# EasyEDA Pro project 嘉立创第九届立创电子设计温湿度检测装置.epro

# Schematic Schematic1
Create Date: 2024-07-06; Page Name: P1; Project Name: 嘉立创第九届立创电子设计温湿度检测装置; Schematic Name: Schematic1; Update Date: 2024-07-06; Company: 嘉立创EDA; Page Size: A4; Version: V1.0
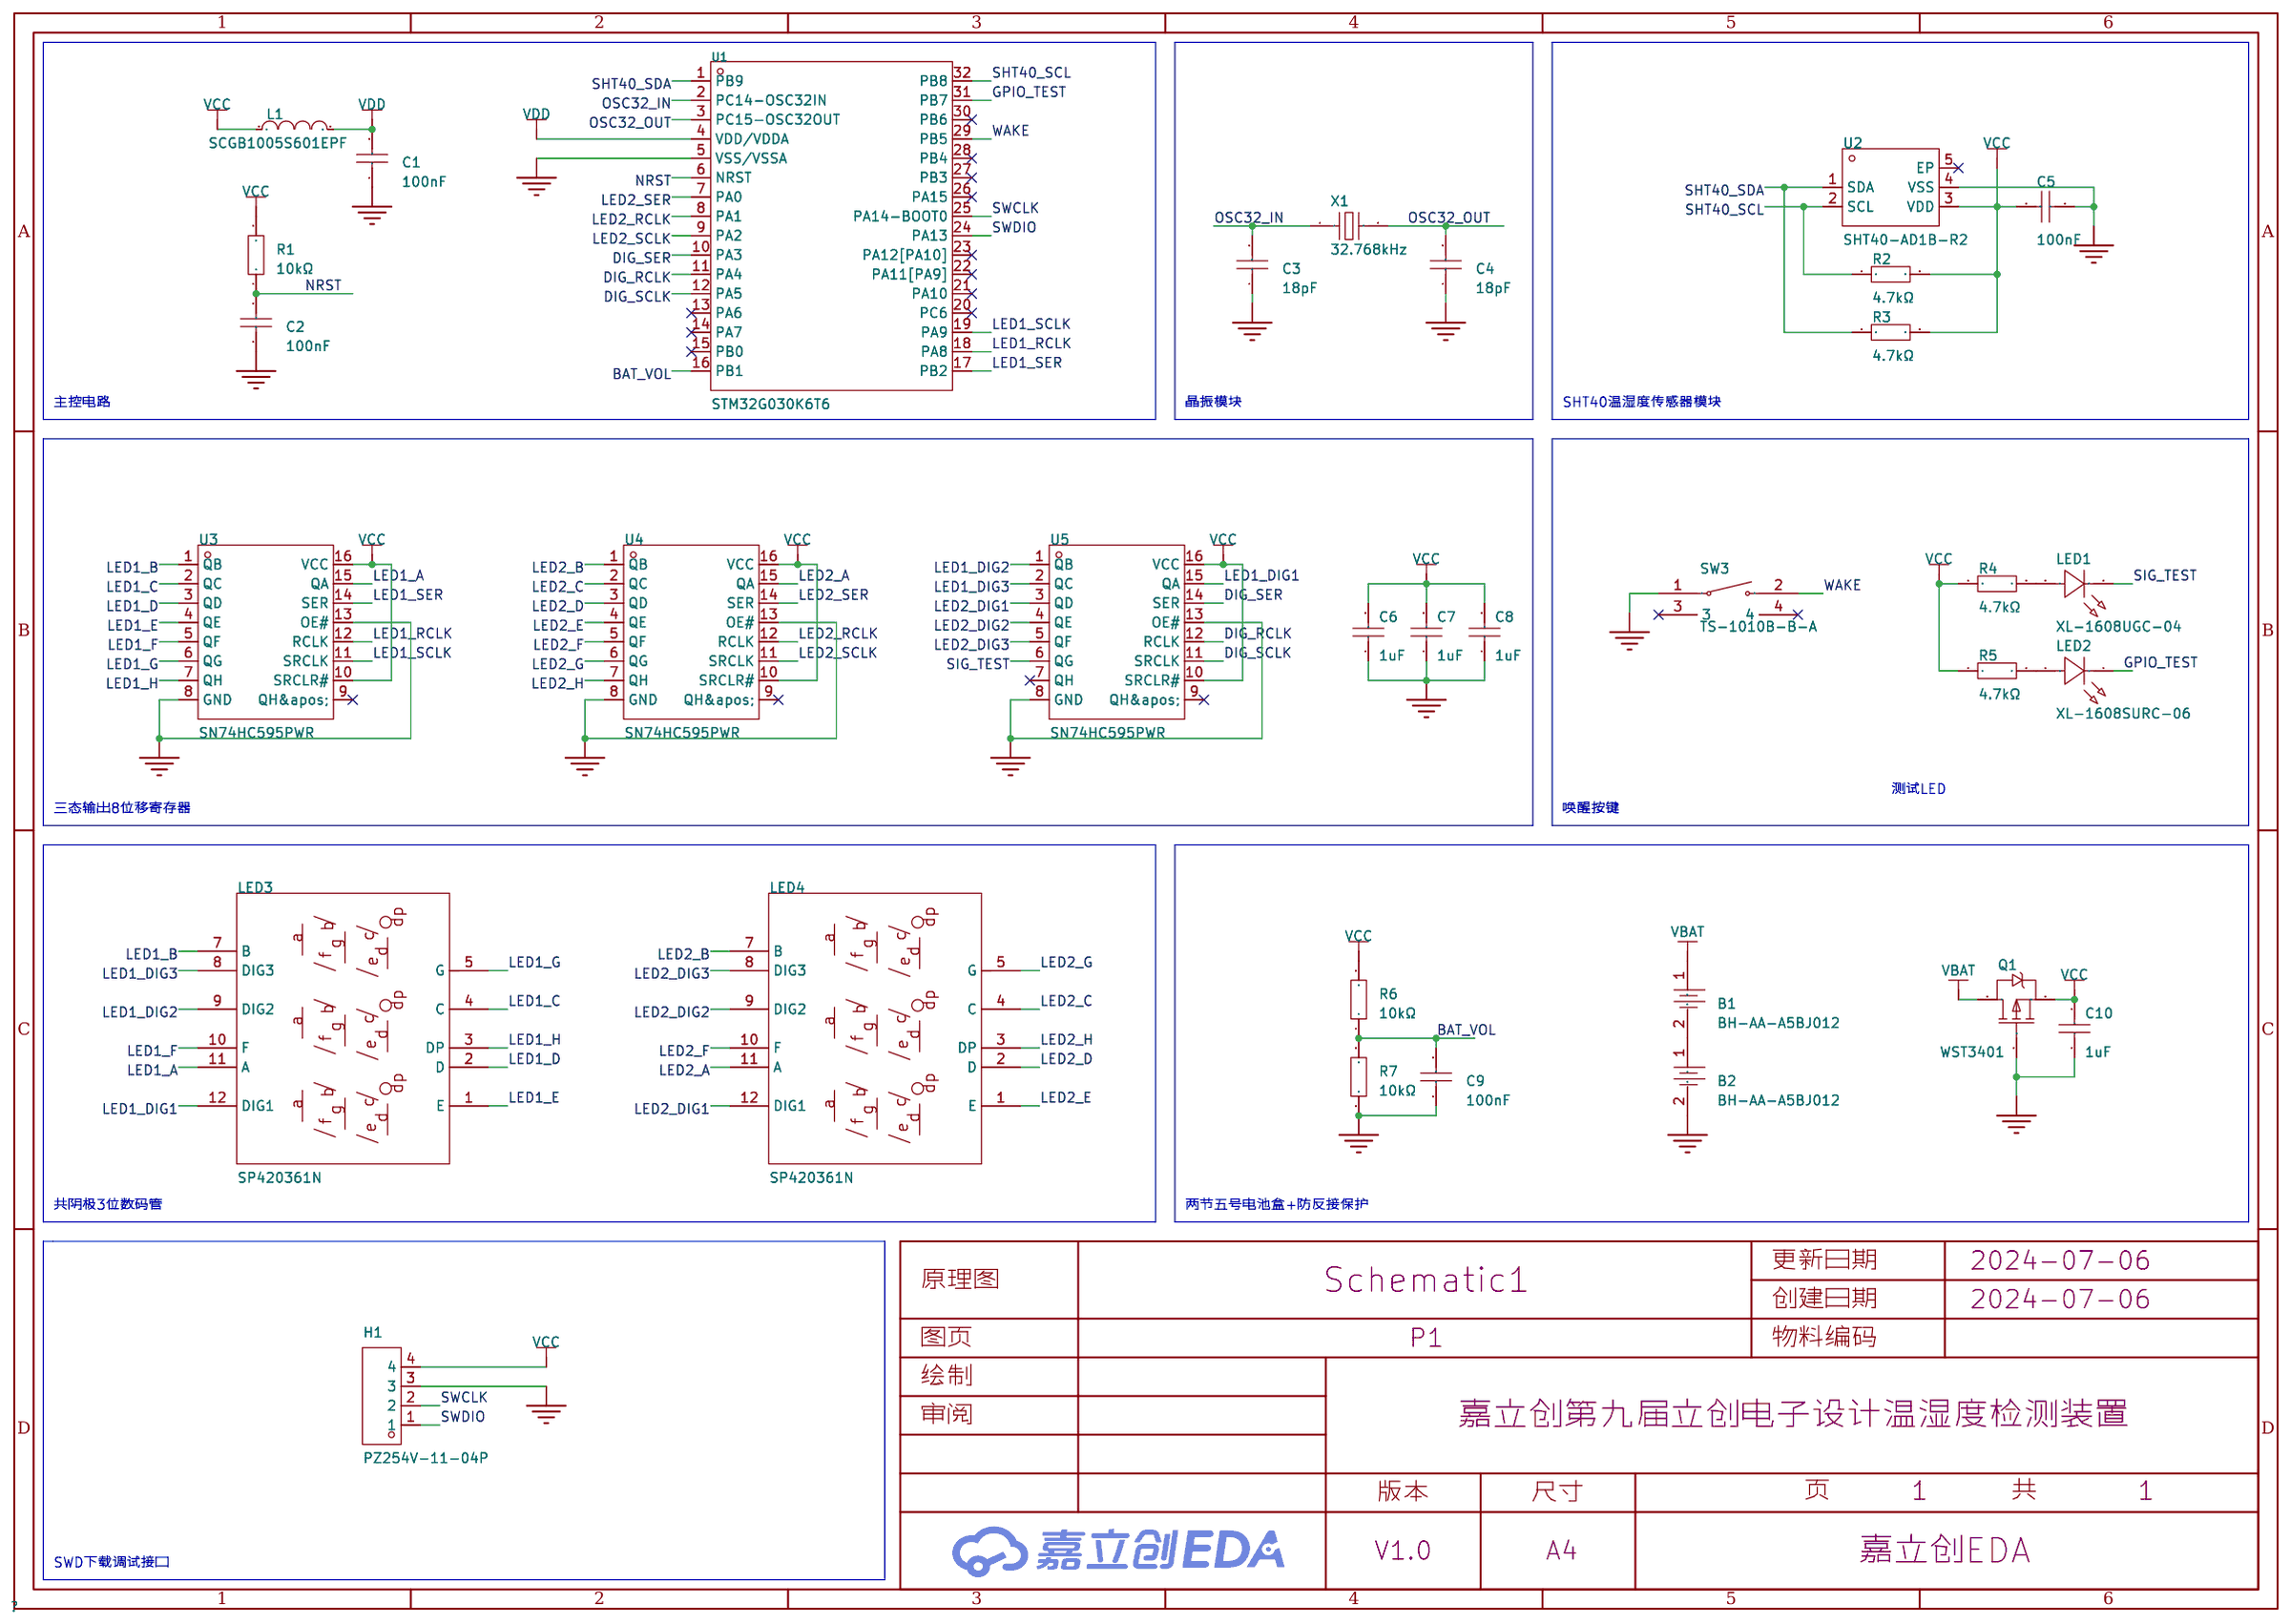
[diagram p0: schematic sheet]

## Parts
B1  BH-AA-A5BJ012  [BAT-TH_BH-AA-A5BJ012]
B2  BH-AA-A5BJ012  [BAT-TH_BH-AA-A5BJ012]
C1  100nF  [C0402]
C2  100nF  [C0402]
C3  18pF  [C0402]
C4  18pF  [C0402]
C5  100nF  [C0402]
C6  1uF  [C0402]
C7  1uF  [C0402]
C8  1uF  [C0402]
C9  100nF  [C0402]
C10  1uF  [C0402]
H1  PZ254V-11-04P  [HDR-TH_4P-P2.54-V-M]
L1  SCGB1005S601EPF  [L0402]
LED1  XL-1608UGC-04  [LED0603-RD_GREEN]
LED2  XL-1608SURC-06  [LED0603-RD_RED]
LED3  SP420361N  [LED-SEG-TH_SP420361N]
LED4  SP420361N  [LED-SEG-TH_SP420361N]
Q1  WST3401  [SOT-23-3_L2.9-W1.6-P1.90-LS2.8-BR]
R1  10kΩ  [R0402]
R2  4.7kΩ  [R0402]
R3  4.7kΩ  [R0402]
R4  4.7kΩ  [R0402]
R5  4.7kΩ  [R0402]
R6  10kΩ  [R0402]
R7  10kΩ  [R0402]
SW3  TS-1010B-B-A  [SW-SMD_TS-1010B-B-A]
U1  STM32G030K6T6  [LQFP-32_L7.0-W7.0-P0.80-LS9.0-BL]
U2  SHT40-AD1B-R2  [DFN-4_L1.5-W1.5-P0.8-TL-EP]
U3  SN74HC595PWR  [TSSOP-16_L5.0-W4.4-P0.65-LS6.4-BL]
U4  SN74HC595PWR  [TSSOP-16_L5.0-W4.4-P0.65-LS6.4-BL]
U5  SN74HC595PWR  [TSSOP-16_L5.0-W4.4-P0.65-LS6.4-BL]
X1  32.768kHz  [OSC-SMD_L3.2-W1.5]

## Library data of the parts
B1 B2 = BH-AA-A5BJ012: 连接器类型:电池盒;适用电池规格:5号;; LCSC Part Name: 电池盒 适用电池:5号; Supplier Part: C5290180; Manufacturer: MYOUNG(美阳); JLCPCB Part Class: 扩展库; Datasheet: https://atta.szlcsc.com/upload/public/pdf/source/20221129/39BBE9EF152B2F12CD5AEA2F9E97207C.pdf; Supplier: LCSC; Connector Type: 电池盒; Battery Type: 5号
C1 C2 C5 C9 = 0402B104K250NT: 容值:100nF;精度:±10%;额定电压:25V;材质(温度系数):X7R;; LCSC Part Name: 100nF ±10% 25V; Supplier Part: C56392; Manufacturer: FH(风华); Supplier Footprint: 0402; JLCPCB Part Class: 扩展库; Datasheet: https://atta.szlcsc.com/upload/public/pdf/source/20200305/C486355_26A10D38EF8C2A5C37091D0039909270.pdf; Supplier: LCSC; Tolerance: ±10%; Voltage Rated: 25V; Temperature Coefficient: X7R
C3 C4 = 0402CG180J500NT: 容值:18pF;精度:±5%;额定电压:50V;材质(温度系数):C0G;; LCSC Part Name: 18pF ±5% 50V; Supplier Part: C1549; Manufacturer: FH(风华); Supplier Footprint: 0402; JLCPCB Part Class: 基础库; Datasheet: https://atta.szlcsc.com/upload/public/pdf/source/20200305/C486355_26A10D38EF8C2A5C37091D0039909270.pdf; Supplier: LCSC; Tolerance: ±5%; Voltage Rated: 50V; Temperature Coefficient: C0G
C6-C8 C10 = 0402X105K6R3NT: 容值:1uF;精度:±10%;额定电压:6.3V;材质(温度系数):X5R;; LCSC Part Name: 1uF ±10% 6.3V; Supplier Part: C142376; Manufacturer: FH(风华); Supplier Footprint: 0402; JLCPCB Part Class: 扩展库; Datasheet: https://atta.szlcsc.com/upload/public/pdf/source/20200305/C486355_26A10D38EF8C2A5C37091D0039909270.pdf; Supplier: LCSC; Tolerance: ±10%; Voltage Rated: 6.3V; Temperature Coefficient: X5R
H1 = PZ254V-11-04P: 插针结构:1x4P;间距:2.54mm;行距:-;圆针/方针:方针;安装类型:直插;排数:单排;总PIN位数:4P;额定电流:3A;额定电压:250V;配合针长度:6mm;塑高:2.5mm;端接针长度:3mm;触头材质:-;工作温度范围:-40℃~+105℃;颜色:黑色;; LCSC Part Name: 间距:2.54mm 1x4P 直插 方针; Supplier Part: C2691448; Manufacturer: XFCN(兴飞); Supplier Footprint: 插件,P=2.54mm; JLCPCB Part Class: 扩展库; Datasheet: https://atta.szlcsc.com/upload/public/pdf/source/20200309/C492403_F9F19131791D08044AD4F84F8E751A34.pdf; Supplier: LCSC; Pin Structure: 1x4P; Pitch: 2.54mm; Circluar Pins/Square Pins: 方针; Mounting Type: 直插; Number of Rows: 单排; Number of Pins: 4P; Current Rating (Max): 3A; Voltage Rating (Max): 250V; Length of Mating Pin: 6mm; Insulation Height: 2.5mm; Length of End Connection Pin: 3mm; Operating Temperature Range: -40℃~+105℃; Color: 黑色
L1 = SCGB1005S601EPF: 标称阻抗@测试频率:600Ω@100MHz;直流电阻(RDC):1Ω;; LCSC Part Name: 单路 0402磁珠 阻抗600Ω@100MHz; Supplier Part: C181004; Manufacturer: SOCAY(硕凯); Supplier Footprint: 0402; JLCPCB Part Class: 扩展库; Datasheet: https://atta.szlcsc.com/upload/public/pdf/source/20180207/C181004_15179897837611356466.pdf; Supplier: LCSC; Impedance @ Frequency: 600Ω@100MHz; DC Resistance: 1Ω; Current Rating: 300mA; Circuits: 1
LED1 = XL-1608UGC-04: 灯头类型:-;发光颜色:翠绿色;正向电压(VF):-;功率:80mW;正向电流:25mA;主波长:516nm~525nm;二极管配置:独立二极管;透镜颜色:无色透明透镜;色温:-;发光强度:-;发光角度:120°;载带方式:正贴;工作温度:-30℃~+85℃;; Supplier Part: C965804; Manufacturer: XINGLIGHT(成兴光); Supplier Footprint: 0603; JLCPCB Part Class: 扩展库; Datasheet: https://atta.szlcsc.com/upload/public/pdf/source/20221102/520D6E465E5CFD1609C8A4DBC80D4018.pdf; Supplier: LCSC; Emitted Color: 翠绿色; Power Dissipation: 80mW; Forward Current: 25mA; Dominant Wavelength: 516nm~525nm; Peak Wavelength: 534nm; Diode Configuration: 独立二极管; Lens Color: 无色透明透镜; Viewing Angle: 120°; Mounting Sytle: 正贴; Operating Temperature: -30℃~+85℃
LED2 = XL-1608SURC-06: 发光颜色:红色;功率:55mW;正向电流:25mA;主波长:617nm~621nm;透镜颜色:无色透明透镜;色温:-;发光角度:120°;载带方式:正贴;工作温度:-30℃~+85℃;; Supplier Part: C965799; Manufacturer: XINGLIGHT(成兴光); Supplier Footprint: 0603; JLCPCB Part Class: 扩展库; Datasheet: https://atta.szlcsc.com/upload/public/pdf/source/20221102/D860AFDD1CDB02C5A8064103A32707E2.pdf; Supplier: LCSC; Emitted Color: 红色; Power Dissipation: 55mW; Forward Current: 25mA; Dominant Wavelength: 617nm~621nm; Peak Wavelength: 623nm; Lens Color: 无色透明透镜; Viewing Angle: 120°; Mounting Sytle: 正贴; Operating Temperature: -30℃~+85℃
LED3 LED4 = SP420361N: 数码管位数:3位;发光颜色:红色;LED极性:共阴极;数字/字母大小(英寸):0.36;; LCSC Part Name: 3位0.36英寸红色数码管 共阴极; Supplier Part: C98927; Manufacturer: ARKLED(方舟); Supplier Footprint: 插件; JLCPCB Part Class: 扩展库; Datasheet: https://atta.szlcsc.com/upload/public/pdf/source/20170713/C98927_1499918920582816853.pdf; Supplier: LCSC; Number of Characters: 3位; Luminous Color: 红色; LED Polarity: 共阴极; Digit/Alpha Size(inch): 0.36
Q1 = WST3401: 类型:1个P沟道;漏源电压(Vdss):30V;连续漏极电流(Id):5.5A;功率(Pd):1W;导通电阻(RDS(on)@Vgs,Id):52mΩ@10V,3A;阈值电压(Vgs(th)@Id):1.2V@250uA;; LCSC Part Name: 1个P沟道 耐压:30V 电流:5.5A; Supplier Part: C105162; Manufacturer: WINSOK(微硕); Supplier Footprint: SOT-23-3L; JLCPCB Part Class: 扩展库; Datasheet: https://atta.szlcsc.com/upload/public/pdf/source/20170518/1495085706351.pdf; Supplier: LCSC; Type: 1个P沟道; Drain Source Voltage (Vdss): 30V; Continuous Drain Current (Id): 5.5A; Power Dissipation (Pd): 1W; Drain Source On Resistance (RDS(on)@Vgs,Id): 52mΩ@10V,3A; Gate Threshold Voltage (Vgs(th)@Id): 1.2V@250uA
R1 R6 R7 = RC0402FR-0710KL: 电阻类型:厚膜电阻;阻值:10kΩ;精度:±1%;功率:62.5mW;最大工作电压:50V;温度系数:±100ppm/℃;; LCSC Part Name: 厚膜电阻 10kΩ ±1% 62.5mW; Supplier Part: C60490; Manufacturer: YAGEO(国巨); Supplier Footprint: 0402; JLCPCB Part Class: 扩展库; Datasheet: https://atta.szlcsc.com/upload/public/pdf/source/20170925/C131467_1506321478108990263.pdf; Supplier: LCSC; Type: 厚膜电阻; Tolerance: ±1%; Power(Watts): 62.5mW; Overload Voltage (Max): 50V; Temperature Coefficient: ±100ppm/℃; Operating Temperature Range: -55℃~+155℃
R2-R5 = RC0402FR-074K7L: 电阻类型:厚膜电阻;阻值:4.7kΩ;精度:±1%;功率:62.5mW;最大工作电压:50V;温度系数:±100ppm/℃;; LCSC Part Name: 厚膜电阻 4.7kΩ ±1% 62.5mW; Supplier Part: C105871; Manufacturer: YAGEO(国巨); Supplier Footprint: 0402; JLCPCB Part Class: 扩展库; Datasheet: https://atta.szlcsc.com/upload/public/pdf/source/20180821/C275644_0D56F95EFF785E7D9A1FEF436B37DA78.pdf; Supplier: LCSC; Type: 厚膜电阻; Tolerance: ±1%; Power(Watts): 62.5mW; Overload Voltage (Max): 50V; Temperature Coefficient: ±100ppm/℃; Operating Temperature Range: -55℃~+155℃
SW3 = TS-1010B-B-A: 电路结构:单刀单掷;按钮形状:矩形按钮;作用力:160gf;安装方式:卧贴;开关长度:4.5mm;开关宽度:2.65mm;开关高度:3.5mm;带支架:不带;触点电流:50mA;额定电压(DC):12V;绝缘电阻:-;带灯:无;机械寿命:10万次;; LCSC Part Name: 4.5*2.65*3.5mm 卧贴 轻触开关; Supplier Part: C381061; Manufacturer: XKB Connectivity(中国星坤); Supplier Footprint: SMD; JLCPCB Part Class: 扩展库; Datasheet: https://atta.szlcsc.com/upload/public/pdf/source/20211011/F72F5FEE4FD72D7D4E4CB639ADBA973D.pdf; Supplier: LCSC; Circuit: 单刀单掷; Actuator Style: 矩形按钮; Operating Force: 160gf; Mounting Style: 卧贴; Switch Length: 4.5mm; Switch Width: 2.65mm; Switch Height: 3.5mm; Strike Gundam: 不带; Contact Current: 50mA; Voltage Rating (DC): 12V; Actuator/Cap Color: 黑色; With Lamp: 无; Mechanical Life: 10万次; Operating Temperature: -30℃~+85℃
U1 = STM32G030K6T6: CPU内核:CM0;程序存储容量:32KB;RAM总容量:8KB;GPIO端口数量:30;工作电压范围:2V~3.6V;CPU最大主频:64MHz;程序存储器类型:FLASH;; Supplier Part: C529331; Manufacturer: ST(意法半导体); Supplier Footprint: LQFP-32(7x7); JLCPCB Part Class: 扩展库; Datasheet: https://atta.szlcsc.com/upload/public/pdf/source/20200511/C529329_A1CB615556C746C4EA827FCAD1461480.pdf; Supplier: LCSC; CPU Core: CM0; Program Storage Size: 32KB; RAM Size: 8KB; GPIO Ports Number: 30; Operating Voltage Range: 2V~3.6V; CPU Maximum Speed: 64MHz; Program Memory Type: FLASH; Operating Temperature Range: -40℃~+85℃; ADC (Bit): 12bit; Peripheral/Function: DMA；PWM; Internal Oscillator: 有
U2 = SHT40-AD1B-R2: ±1.8% / max. ±3.5% RH 数字温湿度传感器; LCSC Part Name: 3.000.465; Supplier Part: C2909890; Manufacturer: Sensirion(瑞士盛思锐); Supplier Footprint: DFN-4-EP(1.5x1.5); JLCPCB Part Class: 扩展库; Datasheet: https://atta.szlcsc.com/upload/public/pdf/source/20211021/851BA36A5CA574D725310F52CADA4510.pdf; Supplier: LCSC
U3-U5 = SN74HC595PWR: 功能:串行至串行或并行;电源电压:2V~6V;元件数:1;每个元件位数:8;; LCSC Part Name: 三态输出 8位串行至串行或并行移位寄存器; Supplier Part: C273642; Manufacturer: TI(德州仪器); Supplier Footprint: TSSOP-16; JLCPCB Part Class: 扩展库; Datasheet: https://www.ti.com/cn/lit/gpn/sn74hc595; Supplier: LCSC; Function: 串行至串行或并行; Supply Voltage: 2V~6V; Number of Elements: 1; Number of Bits per Element: 8; Output Type: 三态; Series: 74HC; Operating Temperature: -40℃~+85℃
X1 = X321532768KGD2SI: 晶振类型:贴片晶振;频率:32.768kHz;常温频差:±20ppm;外接负载电容:12.5pF;频率稳定度(全温):-;; LCSC Part Name: 32.768kHz ±20ppm 12.5pF; Supplier Part: C620155; Manufacturer: YXC(扬兴晶振); Supplier Footprint: SMD3215-2P; JLCPCB Part Class: 扩展库; Datasheet: https://atta.szlcsc.com/upload/public/pdf/source/20240329/3A7650FD985DD0DE85694D3785AB4916.pdf; Supplier: LCSC; Crystal Type: 贴片晶振; Normal temperature Frequency Tolerance: ±20ppm; External load capacitor: 12.5pF; Operating Temperature: -40℃~+85℃

## Nets
GND: B2.2 C1.2 C2.2 C3.1 C4.1 C5.2 C6.1 C7.1 C8.1 C9.2 C10.1 H1.3 Q1.1(G) R7.1 SW3.1 U1.5(VSS/VSSA) U2.4(VSS) U3.8(GND) U3.13(OE#) U4.8(GND) U4.13(OE#) U5.8(GND) U5.13(OE#)
VBAT: B1.1 Q1.3(D)
VCC: C5.1 C6.2 C7.2 C8.2 C10.2 H1.4 L1.1 Q1.2(S) R1.2 R2.2 R3.2 R4.1 R5.1 R6.2 U2.3(VDD) U3.10(SRCLR#) U3.16(VCC) U4.10(SRCLR#) U4.16(VCC) U5.10(SRCLR#) U5.16(VCC)
VDD: C1.1 L1.2 U1.4(VDD/VDDA)
BAT_VOL: C9.1 R6.1 R7.2 U1.16(PB1)
DIG_RCLK: U1.11(PA4) U5.12(RCLK)
DIG_SCLK: U1.12(PA5) U5.11(SRCLK)
DIG_SER: U1.10(PA3) U5.14(SER)
GPIO_TEST: LED2.1(K) U1.31(PB7)
LED1_A: LED3.11(A) U3.15(QA)
LED1_B: LED3.7(B) U3.1(QB)
LED1_C: LED3.4(C) U3.2(QC)
LED1_D: LED3.2(D) U3.3(QD)
LED1_DIG1: LED3.12(DIG1) U5.15(QA)
LED1_DIG2: LED3.9(DIG2) U5.1(QB)
LED1_DIG3: LED3.8(DIG3) U5.2(QC)
LED1_E: LED3.1(E) U3.4(QE)
LED1_F: LED3.10(F) U3.5(QF)
LED1_G: LED3.5(G) U3.6(QG)
LED1_H: LED3.3(DP) U3.7(QH)
LED1_RCLK: U1.18(PA8) U3.12(RCLK)
LED1_SCLK: U1.19(PA9) U3.11(SRCLK)
LED1_SER: U1.17(PB2) U3.14(SER)
LED2_A: LED4.11(A) U4.15(QA)
LED2_B: LED4.7(B) U4.1(QB)
LED2_C: LED4.4(C) U4.2(QC)
LED2_D: LED4.2(D) U4.3(QD)
LED2_DIG1: LED4.12(DIG1) U5.3(QD)
LED2_DIG2: LED4.9(DIG2) U5.4(QE)
LED2_DIG3: LED4.8(DIG3) U5.5(QF)
LED2_E: LED4.1(E) U4.4(QE)
LED2_F: LED4.10(F) U4.5(QF)
LED2_G: LED4.5(G) U4.6(QG)
LED2_H: LED4.3(DP) U4.7(QH)
LED2_RCLK: U1.8(PA1) U4.12(RCLK)
LED2_SCLK: U1.9(PA2) U4.11(SRCLK)
LED2_SER: U1.7(PA0) U4.14(SER)
NRST: C2.1 R1.1 U1.6(NRST)
OSC32_IN: C3.2 U1.2(PC14-OSC32IN) X1.1
OSC32_OUT: C4.2 U1.3(PC15-OSC32OUT) X1.2
SHT40_SCL: R2.1 U1.32(PB8) U2.2(SCL)
SHT40_SDA: R3.1 U1.1(PB9) U2.1(SDA)
SIG_TEST: LED1.1(K) U5.6(QG)
SWCLK: H1.2 U1.25(PA14-BOOT0)
SWDIO: H1.1 U1.24(PA13)
WAKE: SW3.2 U1.29(PB5)
$1N2907: LED1.2(A) R4.2
$1N2993: LED2.2(A) R5.2
$1N3717: B1.2 B2.1

Not connected (* = marked no-connect by the designer): SW3 3* 4*; U1 13(PA6)* 14(PA7)* 15(PB0)* 20(PC6)* 21(PA10)* 22(PA11[PA9])* 23(PA12[PA10])* 26(PA15)* 27(PB3)* 28(PB4)* 30(PB6)*; U2 5(EP)*; U3 9(QH&apos;)*; U4 9(QH&apos;)*; U5 7(QH)* 9(QH&apos;)*

## Notes on the sheet
- 主控电路
- 晶振模块
- SHT40温湿度传感器模块
- 测试LED
- 三态输出8位移寄存器
- 唤醒按键
- 共阴极3位数码管
- 两节五号电池盒+防反接保护
- SWD下载调试接口

# Board PCB1
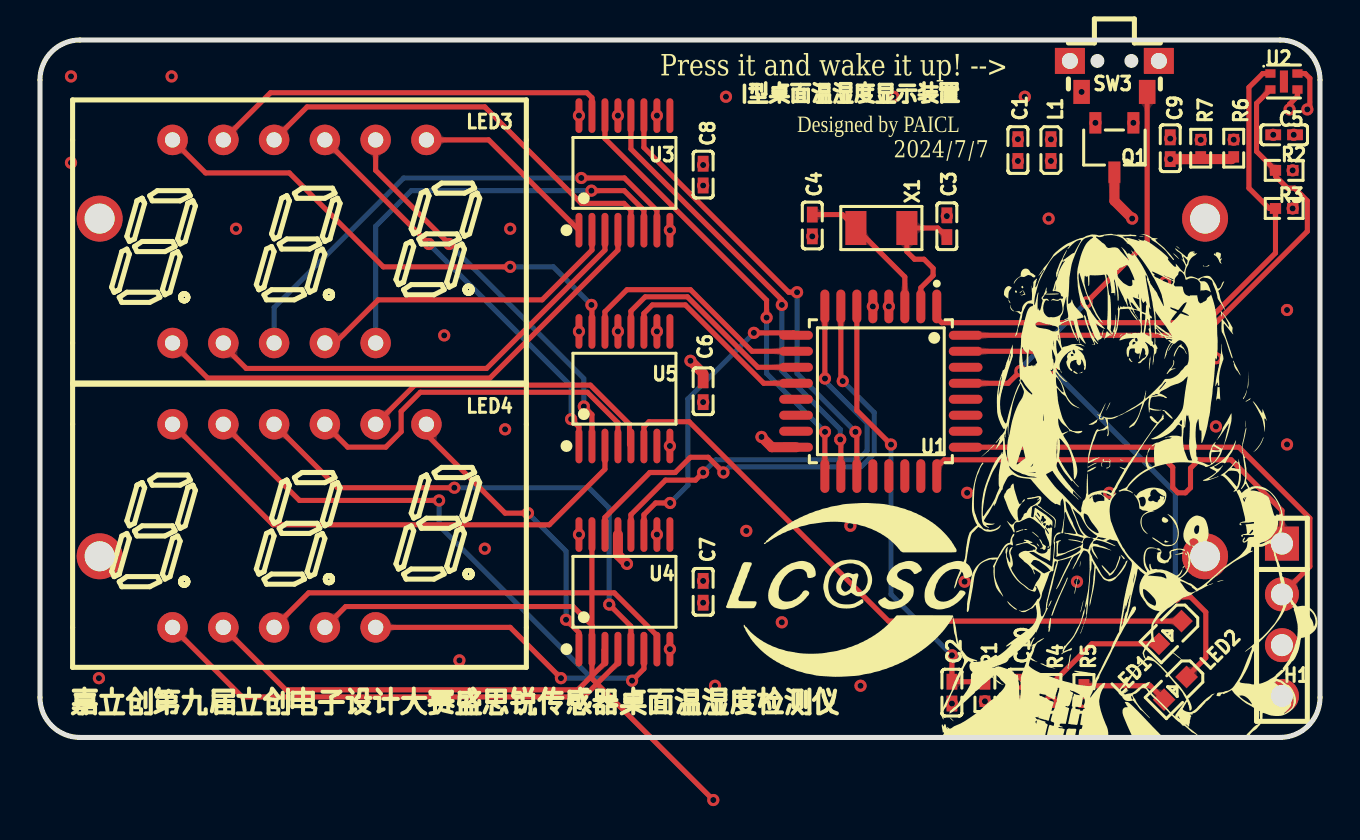
[diagram p1: board, top side]
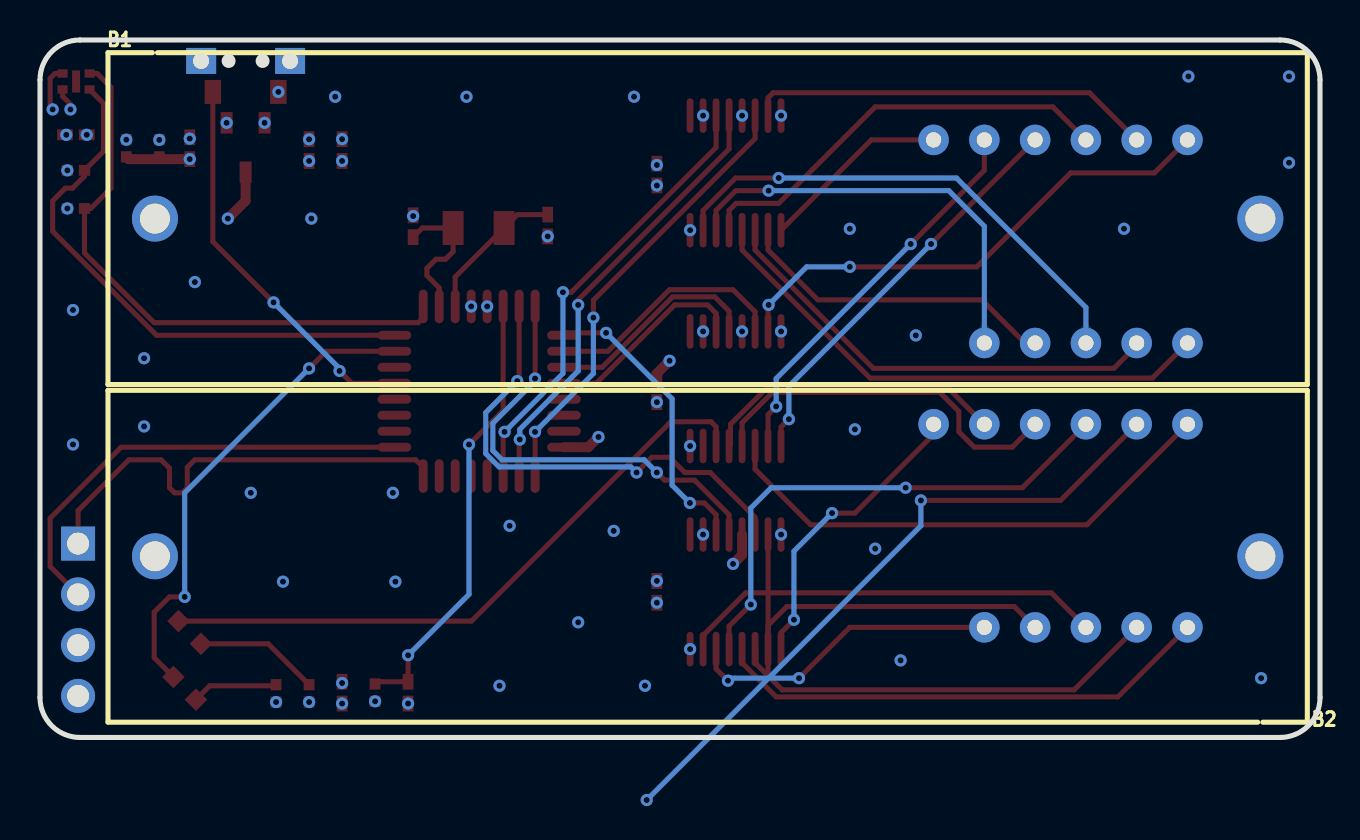
[diagram p2: board, bottom side, seen from below]

Outline 64.04 x 34.89 mm; copper layers: Top Layer, Inner1, Inner2, Bottom Layer. Coordinates in mm from the lower left corner of the outline.
Outline path: 0,32.89 0,2 arc(0.59,0.59) 2,0 62.04,0 arc(63.45,0.59) 64.04,2 64.04,32.89 arc(63.45,34.3) 62.04,34.89 2,34.89 arc(0.59,34.3) 0,32.89
Stack: Top Layer 0.035mm 外层铜厚1oz / Dielectric1 0.2104mm 7628 RC49% 8.6mil / Inner1 0.0152mm 内层铜厚 / Dielectric2 1.065mm 1.1mm H/HOZ 含铜 / Inner2 0.0152mm 内层铜厚 / Dielectric3 0.2104mm 7628 RC49% 8.6mil / Bottom Layer 0.035mm 外层铜厚1oz

## Design rules (mm)
template: JLCPCB Capability(Two Layers Board)
spacing copperThickness1oz (default): track to track 0.102, other pairs 0.152 to 0.3
spacing copperThickness2oz: track to track 0.203, other pairs 0.152 to 0.3
track width copperThickness1oz (default): min 0.127, default 0.254, max 2.54
track width copperThickness2oz: min 0.203, default 0.254, max 2.54
differential pair differentialPair (default): width min 0.127, default 0.254, max 2.54; gap min 0.152, default 0.152
via viaSize (default): diameter min 0.5, default 0.61, max 10; hole min 0.3, default 0.305, max 6.3

## Placement (name value [footprint] x y rotation side)
B1  BH-AA-A5BJ012  [BAT-TH_BH-AA-A5BJ012]  30.64 25.95 180 bottom
B2  BH-AA-A5BJ012  [BAT-TH_BH-AA-A5BJ012]  30.64 9.06 0 bottom
C1  100nF  [C0402]  48.92 29.38 90 top
C2  100nF  [C0402]  45.62 2.24 270 top
C3  18pF  [C0402]  45.37 25.57 270 top
C4  18pF  [C0402]  38.64 25.61 90 top
C5  100nF  [C0402]  62.24 30.14 0 top
C6  1uF  [C0402]  33.17 17.32 90 top
C7  1uF  [C0402]  33.17 7.28 90 top
C8  1uF  [C0402]  33.17 28.16 90 top
C9  100nF  [C0402]  56.54 29.47 90 top
C10  1uF  [C0402]  48.92 2.24 90 top
H1  PZ254V-11-04P  [HDR-TH_4P-P2.54-V-M]  62.13 5.89 270 top
L1  SCGB1005S601EPF  [L0402]  50.57 29.38 270 top
LED1  XL-1608UGC-04  [LED0603-RD_GREEN]  56.54 5.25 225 top
LED2  XL-1608SURC-06  [LED0603-RD_RED]  56.8 2.46 225 top
LED3  SP420361N  [LED-SEG-TH_SP420361N]  12.98 24.81 270 top
LED4  SP420361N  [LED-SEG-TH_SP420361N]  12.98 10.59 270 top
Q1  WST3401  [SOT-23-3_L2.9-W1.6-P1.90-LS2.8-BR]  53.75 29.51 90 top
R1  10kΩ  [R0402]  47.27 2.24 270 top
R2  4.7kΩ  [R0402]  62.24 28.37 0 top
R3  4.7kΩ  [R0402]  62.24 26.46 0 top
R4  4.7kΩ  [R0402]  50.57 2.2 90 top
R5  4.7kΩ  [R0402]  52.23 2.2 90 top
R6  10kΩ  [R0402]  59.72 29.47 90 top
R7  10kΩ  [R0402]  58.07 29.47 270 top
SW3  TS-1010B-B-A  [SW-SMD_TS-1010B-B-A]  53.75 33.07 0 top
U1  STM32G030K6T6  [LQFP-32_L7.0-W7.0-P0.80-LS9.0-BL]  42.07 17.32 180 top
U2  SHT40-AD1B-R2  [DFN-4_L1.5-W1.5-P0.8-TL-EP]  62.23 32.81 0 top
U3  SN74HC595PWR  [TSSOP-16_L5.0-W4.4-P0.65-LS6.4-BL]  29.24 28.24 0 top
U4  SN74HC595PWR  [TSSOP-16_L5.0-W4.4-P0.65-LS6.4-BL]  29.24 7.28 0 top
U5  SN74HC595PWR  [TSSOP-16_L5.0-W4.4-P0.65-LS6.4-BL]  29.24 17.44 0 top
X1  32.768kHz  [OSC-SMD_L3.2-W1.5]  42.09 25.48 180 top

## Footprints (pads in the part's own frame, mm; a bottom-side part is the same pattern mirrored in y, then rotated)
BAT-TH_BH-AA-A5BJ012
  round 2.3 hole 1.5: 1(-27.65,0) 2(27.65,0)
C0402
  rect 0.79x0.54 smd: 1(-0.545,0) 2(0.545,0)
DFN-4_L1.5-W1.5-P0.8-TL-EP
  rect 0.505x0.42 smd: 1(-0.677,0.4) 2(-0.677,-0.4) 3(0.677,-0.4) 4(0.677,0.4)
  rect 0.4x1.1 smd: 5(0,0)
HDR-TH_4P-P2.54-V-M
  rect 1.7x1.7 hole 1.1: 1(-3.81,0)
  round 1.7 hole 1.1: 2(-1.27,0) 3(1.27,0) 4(3.81,0)
L0402
  rect 0.79x0.54 smd: 1(-0.545,0) 2(0.545,0)
LED0603-RD_GREEN
  rect 0.8x0.8 smd: 1(-0.799,-0.004) 2(0.799,0.004)
LED0603-RD_RED
  rect 0.8x0.8 smd: 1(-0.799,-0.004) 2(0.799,0.004)
LED-SEG-TH_SP420361N
  round 1.524 hole 0.762: 1(5.08,-6.35) 2(5.08,-3.81) 3(5.08,-1.27) 4(5.08,1.27) 5(5.08,3.81) 7(-5.08,6.35) 8(-5.08,3.81) 9(-5.08,1.27) 10(-5.08,-1.27) 11(-5.08,-3.81) 12(-5.08,-6.35)
LQFP-32_L7.0-W7.0-P0.80-LS9.0-BL
  oval 0.448x1.684 smd: 1(-2.8,-4.242) 2(-2,-4.242) 3(-1.2,-4.242) 4(-0.4,-4.242) 5(0.4,-4.242) 6(1.2,-4.242) 7(2,-4.242) 8(2.8,-4.242) 17(2.8,4.242) 18(2,4.242) 19(1.2,4.242) 20(0.4,4.242) 21(-0.4,4.242) 22(-1.2,4.242) 23(-2,4.242) 24(-2.8,4.242)
  oval 1.684x0.448 smd: 9(4.242,-2.8) 10(4.242,-2) 11(4.242,-1.2) 12(4.242,-0.4) 13(4.242,0.4) 14(4.242,1.2) 15(4.242,2) 16(4.242,2.8) 25(-4.242,2.8) 26(-4.242,2) 27(-4.242,1.2) 28(-4.242,0.4) 29(-4.242,-0.4) 30(-4.242,-1.2) 31(-4.242,-2) 32(-4.242,-2.8)
OSC-SMD_L3.2-W1.5
  rect 1.05x1.7 smd: 1(-1.275,0) 2(1.275,0)
R0402
  rect 0.566x0.54 smd: 1(-0.433,0) 2(0.433,0)
SOT-23-3_L2.9-W1.6-P1.90-LS2.8-BR
  rect 1.07x0.6 smd: 1(1.235,-0.95) 2(1.235,0.95) 3(-1.235,0)
SW-SMD_TS-1010B-B-A
  rect 0.825x1.2 smd: 1(-1.64,-0.775) 2(1.64,-0.775)
  rect 1.5x1.3 hole 0.8: 3(-2.225,0.775) 4(2.225,0.775)
TSSOP-16_L5.0-W4.4-P0.65-LS6.4-BL
  oval 0.343x1.732 smd: 1(-2.275,-2.866) 2(-1.625,-2.866) 3(-0.975,-2.866) 4(-0.325,-2.866) 5(0.325,-2.866) 6(0.975,-2.866) 7(1.625,-2.866) 8(2.275,-2.866) 9(2.275,2.866) 10(1.625,2.866) 11(0.975,2.866) 12(0.325,2.866) 13(-0.325,2.866) 14(-0.975,2.866) 15(-1.625,2.866) 16(-2.275,2.866)

## Nets
As in the schematic.

Pads without a net: SW3 3 4; U1 13 14 15 20 21 22 23 26 27 28 30; U2 5; U3 9; U4 9; U5 7 9

## Via types
v1: diameter 0.61, hole 0.305, Top Layer to Bottom Layer, 109 vias

## Routing (per net, layer and track width the routed paths; a pad name or vN(x,y) marks a point on that pad's centre or on a via; arc(x,y) is an arc through that point)
GND: length 121
  Top Layer w0.254: U2.4 63.29,33.21 63.53,32.97 63.53,31.54 v1(63.4,31.41)
  Top Layer w0.5: 28.91,10.15 28.91,9.13 v1(29.36,8.68)
  Inner2 w0.254: H1.3 58.29,8.46 B2.2 55.65,9.06 51.59,5 51.59,4.36 v1(48.92,1.7) 48.54,1.7 47.53,2.71 47.27,2.71 46.26,1.7 v1(45.62,1.7) 40.58,6.74 v1(33.17,6.74) ; v1(33.17,6.74) 31.23,8.68 v1(29.36,8.68) 29.36,12.43 v1(31.51,14.58) 33.17,16.24 v1(33.17,16.77) 29.64,20.31 v1(28.91,20.31) 31.51,22.91 v1(31.51,25.37) 33.17,27.04 v1(33.17,27.61) ; v1(33.17,6.74) 31.51,5.08 v1(31.51,4.42) ; v1(63.4,31.41) 63.4,30.78 62.77,30.14 ; v1(33.17,27.61) 36.09,27.61 v1(38.64,25.06) 38.64,24.59 v1(41.67,21.56) 41.67,21.92 42.66,22.91 44.23,22.91 45.37,24.05 v1(45.37,26.08) 45.37,26.72 48.58,29.93 v1(48.92,29.93) 51.29,32.29 v1(52.11,32.29) 53.15,32.29 v1(54.7,30.74) 55.75,30.74 v1(56.54,29.95) 56.61,29.89 v1(58.07,29.89) 58.96,30.78 62.13,30.78 62.72,30.19 v1(62.72,30.14) ; v1(33.17,27.61) 32.41,27.61 v1(28.91,31.11)
VBAT: length 6.3
  Top Layer w0.5: v1(54.64,25.95) 53.75,26.84 Q1.3
  Inner1 w0.5: v1(54.64,25.95) B1.1
VCC: length 115.9
  Top Layer w0.254: U2.3 62.91,32.07 62.51,31.68 v1(62.51,31.41)
  Top Layer w0.5: v1(32.54,18.84) 33.17,18.21 C6.2
  Inner1 w0.254: v1(30.86,20.31) 32.29,21.73 32.29,27.75 v1(33.17,28.64) ; v1(30.86,20.31) 31.07,20.31 v1(32.54,18.84) 32.41,18.71 32.41,14.65 30.89,13.13 30.89,10.18 v1(30.86,10.15) ; v1(30.86,20.31) 29.92,21.25 28.34,21.25 27.39,20.31 v1(26.96,20.31) ; v1(62.51,31.41) 62.51,30.96 v1(61.7,30.14) 62.67,29.17 v1(62.67,28.37) v1(62.67,26.46) 59.72,29.41 v1(59.72,29.9) 58.46,31.16 56.92,31.16 56.16,31.92 54.13,31.92 52.95,30.74 v1(52.8,30.74) 51.97,29.92 v1(50.57,29.92) 49.21,31.29 47.27,31.29 44.62,28.64 v1(33.17,28.64) ; v1(33.17,28.64) 33.17,28.79 v1(30.86,31.11) 30.44,31.11 29.49,32.05 27.91,32.05 v1(26.96,31.11) ; v1(30.86,10.15) 33.17,7.84 v1(33.17,7.83) 40.76,7.83 46.51,2.08 47,2.08 v1(47.27,1.81) 48.19,2.72 v1(48.92,2.72) 49.62,2.72 v1(50.57,1.77) v1(52.23,1.77) 61.83,1.77 62.13,2.08 ; v1(30.86,10.15) v1(26.96,10.15)
VDD: length 12.1
  Inner1 w0.5: v1(42.47,21.56) 43.39,21.56 48.92,27.1 v1(48.92,28.84) v1(50.57,28.84)
(no net):
  vias: v1(1.55,33.07) v1(1.55,28.75) v1(2.95,2.97) v1(6.59,33.07) v1(9.81,25.45) v1(20.22,20.11) v1(20.98,3.86) v1(22.25,9.44) v1(23.27,15.41) v1(23.52,25.45) v1(33.77,2.59) v1(34.32,32.05) v1(35.33,10.33) v1(37.11,5.76) v1(40.54,10.59) v1(41.05,2.59) v1(42.7,32.05) v1(46.26,7.79) v1(46.38,12.24) v1(49.27,32.05) v1(50.46,25.95) v1(51.88,7.79) v1(53.49,12.24) v1(56.29,22.78) v1(58.83,18.97) v1(58.83,15.56) v1(62.39,21.38) v1(62.39,14.66)
BAT_VOL: length 33.2
  Top Layer w0.5: 59.72,29.04 59.61,28.93 v1(56.54,28.93) ; v1(36.1,15.03) 36.61,14.52 U1.16
  Inner1 w0.5: v1(56.54,28.93) 56.09,28.93 53.33,26.17 53.33,25.04 50.56,22.27 45.87,22.27 44.22,20.62 39.72,20.62 36.1,16.99 v1(36.1,15.03)
DIG_RCLK: length 11
  Top Layer w0.254: U5.12 29.56,21.33 30.28,22.04 32.39,22.04 35.91,18.52 U1.11
DIG_SCLK: length 10.3
  Top Layer w0.254: U1.12 36.2,17.72 32.29,21.64 30.64,21.64 30.21,21.21 U5.11
DIG_SER: length 12.3
  Top Layer w0.254: U5.14 28.26,21.3 29.36,22.4 32.54,22.4 35.62,19.32 U1.10
GPIO_TEST: length 24.1
  Top Layer w0.254: v1(50.57,18.46) 49.72,19.32 U1.31 ; LED2.1 58.32,3.99 58.32,6.27 57.56,7.03 v1(56.8,7.03)
  Bottom Layer w0.254: v1(56.8,7.03) 56.8,12.24 v1(50.57,18.46)
LED1_A: length 20.4
  Top Layer w0.254: LED3.11 11.53,32.25 27.36,32.25 27.61,32 U3.15
LED1_B: length 9.5
  Top Layer w0.254: U3.1 22.45,29.89 LED3.7
LED1_C: length 16.3
  Top Layer w0.254: U3.2 27.61,24.38 25.12,21.89 16.92,21.89 14.76,19.73 LED3.4
LED1_D: length 23.1
  Top Layer w0.254: LED3.2 9.17,19.6 10.32,18.46 22.34,18.46 28.26,24.38 U3.3
LED1_DIG1: length 25.7
  Top Layer w0.254: LED3.12 8.28,28.24 12.47,28.24 17.17,23.54 v1(23.52,23.54) ; U5.15 27.61,21.61 v1(27.59,21.64)
  Bottom Layer w0.254: v1(23.52,23.54) 25.68,23.54 v1(27.59,21.64)
LED1_DIG2: length 20.6
  Top Layer w0.254: U5.1 26.96,15.53 v1(26.57,15.92) ; v1(19.46,24.68) LED3.9
  Bottom Layer w0.254: v1(19.46,24.68) 26.57,17.57 v1(26.57,15.92)
LED1_DIG3: length 19.8
  Top Layer w0.254: v1(20.48,24.68) 16.79,28.37 LED3.8 ; v1(27.21,16.56) 27.61,16.15 U5.2
  Bottom Layer w0.254: v1(27.21,16.56) 27.21,17.95 v1(20.48,24.68)
LED1_E: length 26.7
  Top Layer w0.254: LED3.1 8.38,17.98 22.51,17.98 28.91,24.38 28.91,25.37
LED1_F: length 21.7
  Top Layer w0.254: U3.5 29.56,26.37 29.21,26.72 27.08,26.72 22.25,31.54 13.36,31.54 LED3.10
LED1_G: length 21.4
  Top Layer w0.254: v1(27.59,27.35) 29.23,27.35 30.21,26.37 U3.6
  Bottom Layer w0.254: LED3.5 16.79,25.57 18.57,27.35 v1(27.59,27.35)
LED1_H: length 25.3
  Top Layer w0.254: U3.7 30.86,26.36 29.24,27.98 v1(27.08,27.98)
  Bottom Layer w0.254: LED3.3 11.71,21.51 18.19,27.98 v1(27.08,27.98)
LED1_RCLK: length 22.4
  Top Layer w0.254: U3.12 29.56,29.44 37.11,21.89 v1(37.11,21.64) ; v1(40.03,14.9) 40.07,14.87 U1.18
  Bottom Layer w0.254: v1(37.11,21.64) 37.11,18.33 40.03,15.41 v1(40.03,14.9)
LED1_SCLK: length 22.7
  Top Layer w0.254: 40.86,13.08 40.86,15.22 v1(40.8,15.29) ; v1(37.87,22.27) 37.45,22.27 30.21,29.51 U3.11
  Bottom Layer w0.254: v1(37.87,22.27) 37.87,18.21 v1(40.8,15.29)
LED1_SER: length 22.6
  Top Layer w0.254: U1.17 39.27,15.28 v1(39.27,15.29) ; U3.14 28.26,29.96 36.35,21.87 v1(36.35,21)
  Bottom Layer w0.254: v1(36.35,21) 36.35,18.21 v1(39.27,15.29)
LED2_A: length 48.8
  Top Layer w0.254: v1(19.97,11.86) 12.98,11.86 LED4.11 ; U4.15 27.61,2.94 v1(33.68,-3.13)
  Bottom Layer w0.254: v1(19.97,11.86) 19.97,10.59 v1(33.68,-3.13)
LED2_B: length 15.1
  Top Layer w0.254: LED4.7 19.33,15.16 23.27,11.22 v1(24.41,11.22) ; U4.1 26.96,5.24 v1(26.32,5.89)
  Bottom Layer w0.254: v1(26.32,5.89) 26.32,9.32 v1(24.41,11.22)
LED2_C: length 15.4
  Top Layer w0.254: U4.2 27.61,5.61 26.67,6.55 15.29,6.55 LED4.4
LED2_D: length 21.6
  Top Layer w0.254: LED4.2 12.3,2.38 26.91,2.38 28.22,3.7 28.22,4.38 U4.3
LED2_DIG1: length 26
  Top Layer w0.254: U5.3 28.26,13.42 25.48,10.64 11.66,10.64 LED4.12
LED2_DIG2: length 18.7
  Top Layer w0.254: LED4.9 15.39,14.52 17.3,14.52 18.07,15.29 18.07,16.31 19.03,17.27 27.38,17.27 28.91,15.74 28.91,14.58
LED2_DIG3: length 15.4
  Top Layer w0.254: U5.5 29.49,14.65 29.49,15.67 27.54,17.62 18.75,17.62 LED4.8
LED2_E: length 25.1
  Top Layer w0.254: LED4.1 10.11,2.03 27.2,2.03 28.91,3.74 28.91,4.42
LED2_F: length 26
  Top Layer w0.254: LED4.10 14.89,12.49 v1(20.73,12.49) ; U4.5 29.56,5.56 v1(28.48,6.65)
  Bottom Layer w0.254: v1(28.48,6.65) 28.48,11.48 27.46,12.49 v1(20.73,12.49)
LED2_G: length 15.8
  Top Layer w0.254: U4.6 30.21,3.43 v1(29.62,2.84) ; v1(26.06,2.97) 23.52,5.51 LED4.5
  Bottom Layer w0.254: v1(29.62,2.84) 29.49,2.97 v1(26.06,2.97)
LED2_H: length 21.4
  Top Layer w0.254: LED4.3 13.44,7.23 28.73,7.23 30.86,5.1 U4.7
LED2_RCLK: length 22.2
  Top Layer w0.254: v1(39.27,17.95) 39.27,17.96 U1.8 ; U4.12 29.56,11.14 31.29,12.87 32.79,12.87 v1(33.17,13.25)
  Bottom Layer w0.254: v1(39.27,17.95) 39.27,17.83 41.38,15.72 41.38,14.35 40.92,13.89 33.81,13.89 v1(33.17,13.25)
LED2_SCLK: length 14.9
  Top Layer w0.254: U4.11 30.21,11.14 30.8,11.73 v1(31.52,11.73) ; U1.9 37.7,20.24 v1(35.72,20.24)
  Bottom Layer w0.254: v1(35.72,20.24) 32.41,16.94 32.41,12.62 v1(31.52,11.73)
LED2_SER: length 24.3
  Top Layer w0.254: v1(34.19,13.25) 33.43,14.02 32.54,14.02 31.78,13.25 30.51,13.25 28.26,11.01 U4.14 ; v1(40.16,17.83) 40.07,17.92 U1.7
  Bottom Layer w0.254: v1(40.16,17.83) 41.73,16.25 41.73,14.2 41.07,13.53 34.47,13.53 v1(34.19,13.25)
NRST: length 22.4
  Top Layer w0.254: R1.1 47.16,2.79 C2.1 v1(45.62,4.11) ; v1(42.57,14.65) 40.86,16.36 40.86,21.56
  Bottom Layer w0.254: v1(45.62,4.11) 42.57,7.16 v1(42.57,14.65)
OSC32_IN: length 7.2
  Top Layer w0.254: C3.2 44.91,25.48 X1.1 43.37,24.3 43.75,23.92 44.22,23.92 44.68,23.47 44.68,23.11 44.07,22.49 U1.2
OSC32_OUT: length 7.5
  Top Layer w0.254: 43.27,21.5 43.27,23.03 X1.2 40.14,26.15 C4.2
SHT40_SCL: length 27.9
  Top Layer w0.254: U1.32 58.2,20.12 63.4,25.32 63.4,26.84 62.77,27.48 62.41,27.48 61.81,28.08 R2.1 60.86,29.31 60.86,31.72 U2.2
SHT40_SDA: length 29.4
  Top Layer w0.254: U2.1 61.17,33.21 60.48,32.52 60.48,27.48 61.5,26.46 R3.1 61.81,24.23 58.32,20.75 45.11,20.75 44.86,20.99 44.86,21.56
SIG_TEST: length 32.1
  Top Layer w0.254: U5.6 30.21,15.54 30.47,15.79 32.48,15.79 42.45,5.82 LED1.1
SWCLK: length 23.1
  Top Layer w0.254: U1.25 59.98,14.52 63.53,10.97 63.53,8.55 62.13,7.16
SWDIO: length 23.1
  Top Layer w0.254: 62.13,9.72 62.13,11.35 59.59,13.89 57.98,13.89 57.56,13.47 57.56,12.49 57.3,12.24 56.92,12.24 56.67,12.49 56.67,13.51 56.29,13.89 45.24,13.89 44.86,13.51 44.86,13.08
WAKE: length 19.6
  Top Layer w0.254: v1(52.35,21.76) 55.39,24.8 SW3.2 ; U1.29 48.43,17.72 v1(49.05,18.33)
  Bottom Layer w0.254: v1(49.05,18.33) 49.05,18.46 v1(52.35,21.76)
$1N2907: length 6.3
  Top Layer w0.254: LED1.2 52.62,4.68 R4.2
$1N2993: length 4.2
  Top Layer w0.254: LED2.2 55.54,2.59 52.28,2.59
$1N3717: length 16.9
  Inner1 w1: B1.2 B2.1

## Copper pours and planes (outline as drawn; the poured copper is in the pictures)
GND on Top Layer: -1.7,33.35 -1.68,33.63 -1.62,33.91 -1.52,34.18 -1.38,34.43 -1.21,34.66 -1.01,34.86 -0.78,35.03 -0.53,35.17 -0.26,35.27 0.01,35.33 0.3,35.35 63.38,35.35 63.67,35.33 63.95,35.27 64.21,35.17 64.46,35.03 64.69,34.86 64.89,34.66 65.07,34.43 65.2,34.18 65.3,33.91 65.36,33.63 65.38,33.35 65.38,-10.62 65.36,-10.91 65.3,-11.19 65.2,-11.45 65.07,-11.7 64.89,-11.93 64.69,-12.13 64.46,-12.31 64.21,-12.44 63.95,-12.54 63.67,-12.6 63.38,-12.62 0.3,-12.62 0.01,-12.6 -0.26,-12.54 -0.53,-12.44 -0.78,-12.31 -1.01,-12.13 -1.21,-11.93 -1.38,-11.7 -1.52,-11.45 -1.62,-11.19 -1.68,-10.91 -1.7,-10.62
GND on Bottom Layer: -2.22,49.63 -2.2,49.91 -2.14,50.19 -2.04,50.46 -1.9,50.71 -1.73,50.94 -1.53,51.14 -1.3,51.31 -1.05,51.45 -0.78,51.55 -0.5,51.61 -0.22,51.63 63.37,51.63 63.66,51.61 63.94,51.55 64.2,51.45 64.45,51.31 64.68,51.14 64.88,50.94 65.06,50.71 65.19,50.46 65.29,50.19 65.35,49.91 65.37,49.63 65.37,-0.06 65.35,-0.34 65.29,-0.62 65.19,-0.89 65.06,-1.14 64.88,-1.37 64.68,-1.57 64.45,-1.74 64.2,-1.87 63.94,-1.97 63.66,-2.04 63.37,-2.06 -0.22,-2.06 -0.5,-2.04 -0.78,-1.97 -1.05,-1.87 -1.3,-1.74 -1.53,-1.57 -1.73,-1.37 -1.9,-1.14 -2.04,-0.89 -2.14,-0.62 -2.2,-0.34 -2.22,-0.06
GND on Inner2: -13.89,35.49 -13.87,35.78 -13.81,36.05 -13.71,36.32 -13.58,36.57 -13.4,36.8 -13.2,37 -12.97,37.17 -12.72,37.31 -12.46,37.41 -12.18,37.47 -11.89,37.49 63.76,37.49 64.05,37.47 64.33,37.41 64.6,37.31 64.85,37.17 65.07,37 65.28,36.8 65.45,36.57 65.58,36.32 65.68,36.05 65.74,35.78 65.76,35.49 65.76,0.16 65.74,-0.13 65.68,-0.4 65.58,-0.67 65.45,-0.92 65.28,-1.15 65.07,-1.35 64.85,-1.52 64.6,-1.66 64.33,-1.76 64.05,-1.82 63.76,-1.84 -11.89,-1.84 -12.18,-1.82 -12.46,-1.76 -12.72,-1.66 -12.97,-1.52 -13.2,-1.35 -13.4,-1.15 -13.58,-0.92 -13.71,-0.67 -13.81,-0.4 -13.87,-0.13 -13.89,0.16
VCC on Inner1: -0.85,33.95 -0.83,34.23 -0.77,34.51 -0.67,34.78 -0.53,35.03 -0.36,35.26 -0.16,35.46 0.07,35.63 0.32,35.77 0.59,35.87 0.86,35.93 1.15,35.95 75.79,35.95 76.08,35.93 76.35,35.87 76.62,35.77 76.87,35.63 77.1,35.46 77.3,35.26 77.47,35.03 77.61,34.78 77.71,34.51 77.77,34.23 77.79,33.95 77.79,0.52 77.77,0.24 77.71,-0.04 77.61,-0.31 77.47,-0.56 77.3,-0.79 77.1,-0.99 76.87,-1.16 76.62,-1.3 76.35,-1.4 76.08,-1.46 75.79,-1.48 1.15,-1.48 0.86,-1.46 0.59,-1.4 0.32,-1.3 0.07,-1.16 -0.16,-0.99 -0.36,-0.79 -0.53,-0.56 -0.67,-0.31 -0.77,-0.04 -0.83,0.24 -0.85,0.52

Small or netless copper shapes (teardrops, artwork), in the pictures only: 124 on Top Layer, 33 on Bottom Layer, 45 on Inner1, 44 on Inner2

## Text on the board
Top Silkscreen Layer: Designed by PAICL | I型桌面温湿度显示装置 | 2024/7/7 | 嘉立创第九届立创电子设计大赛盛思锐传感器桌面温湿度检测仪 | Press it and wake it up! -->
